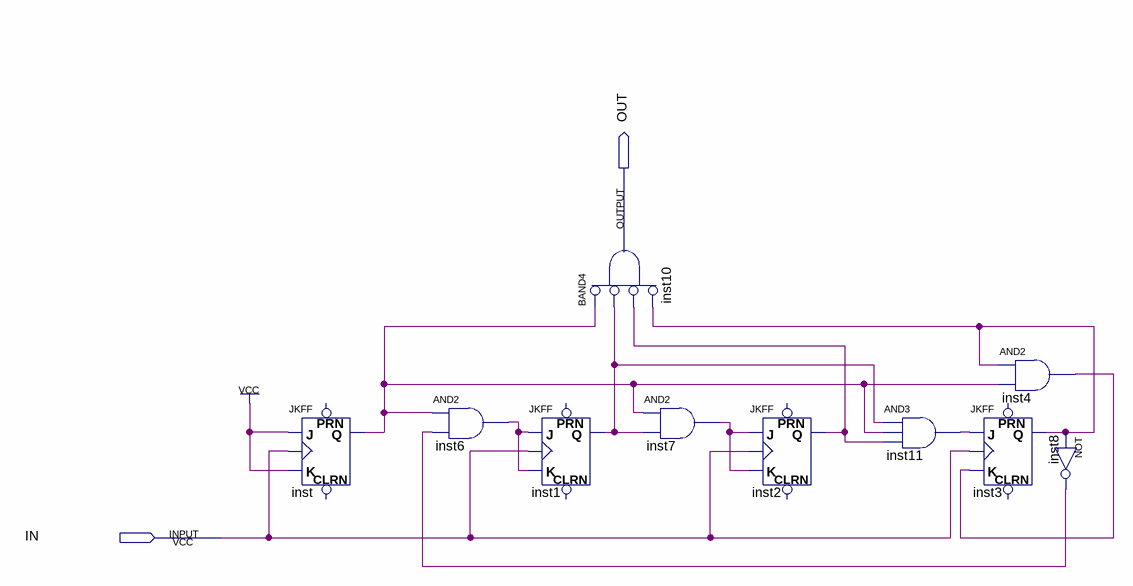
[diagram p0: schematic sheet]
// Quartus schematic decadic_div.bdf as structural Verilog: 10 symbols, 2 pins
module decadic_div (
  input  IN,
  output OUT
);

  wire inst1_q, inst2_q, inst3_q, inst4_out, inst6_out, inst7_out, inst8_out, inst11_out, inst_q;

  JKFF inst (.K(1'b1), .J(1'b1), .CLK(IN), .Q(inst_q));  // open: PRN, CLRN
  and inst6 (inst6_out, inst_q, inst8_out);
  JKFF inst1 (.K(inst6_out), .J(inst6_out), .CLK(IN), .Q(inst1_q));  // open: PRN, CLRN
  and inst10 (OUT, ~inst_q, ~inst1_q, ~inst2_q, ~inst3_q);  // BAND4
  and inst7 (inst7_out, inst_q, inst1_q);
  JKFF inst2 (.K(inst7_out), .J(inst7_out), .CLK(IN), .Q(inst2_q));  // open: PRN, CLRN
  and inst11 (inst11_out, inst1_q, inst_q, inst2_q);
  and inst4 (inst4_out, inst3_q, inst_q);
  JKFF inst3 (.K(inst4_out), .J(inst11_out), .CLK(IN), .Q(inst3_q));  // open: PRN, CLRN
  not inst8 (inst8_out, inst3_q);
endmodule
